# EasyEDA schematic SCH_PoC Interrupt Jao.json
TITLE: PoC Interrupt; REV: 1.0; Date: 15/12/2023; Sheet: 1/1; Drawn By: Jao Dekeyser; Company: HoGent
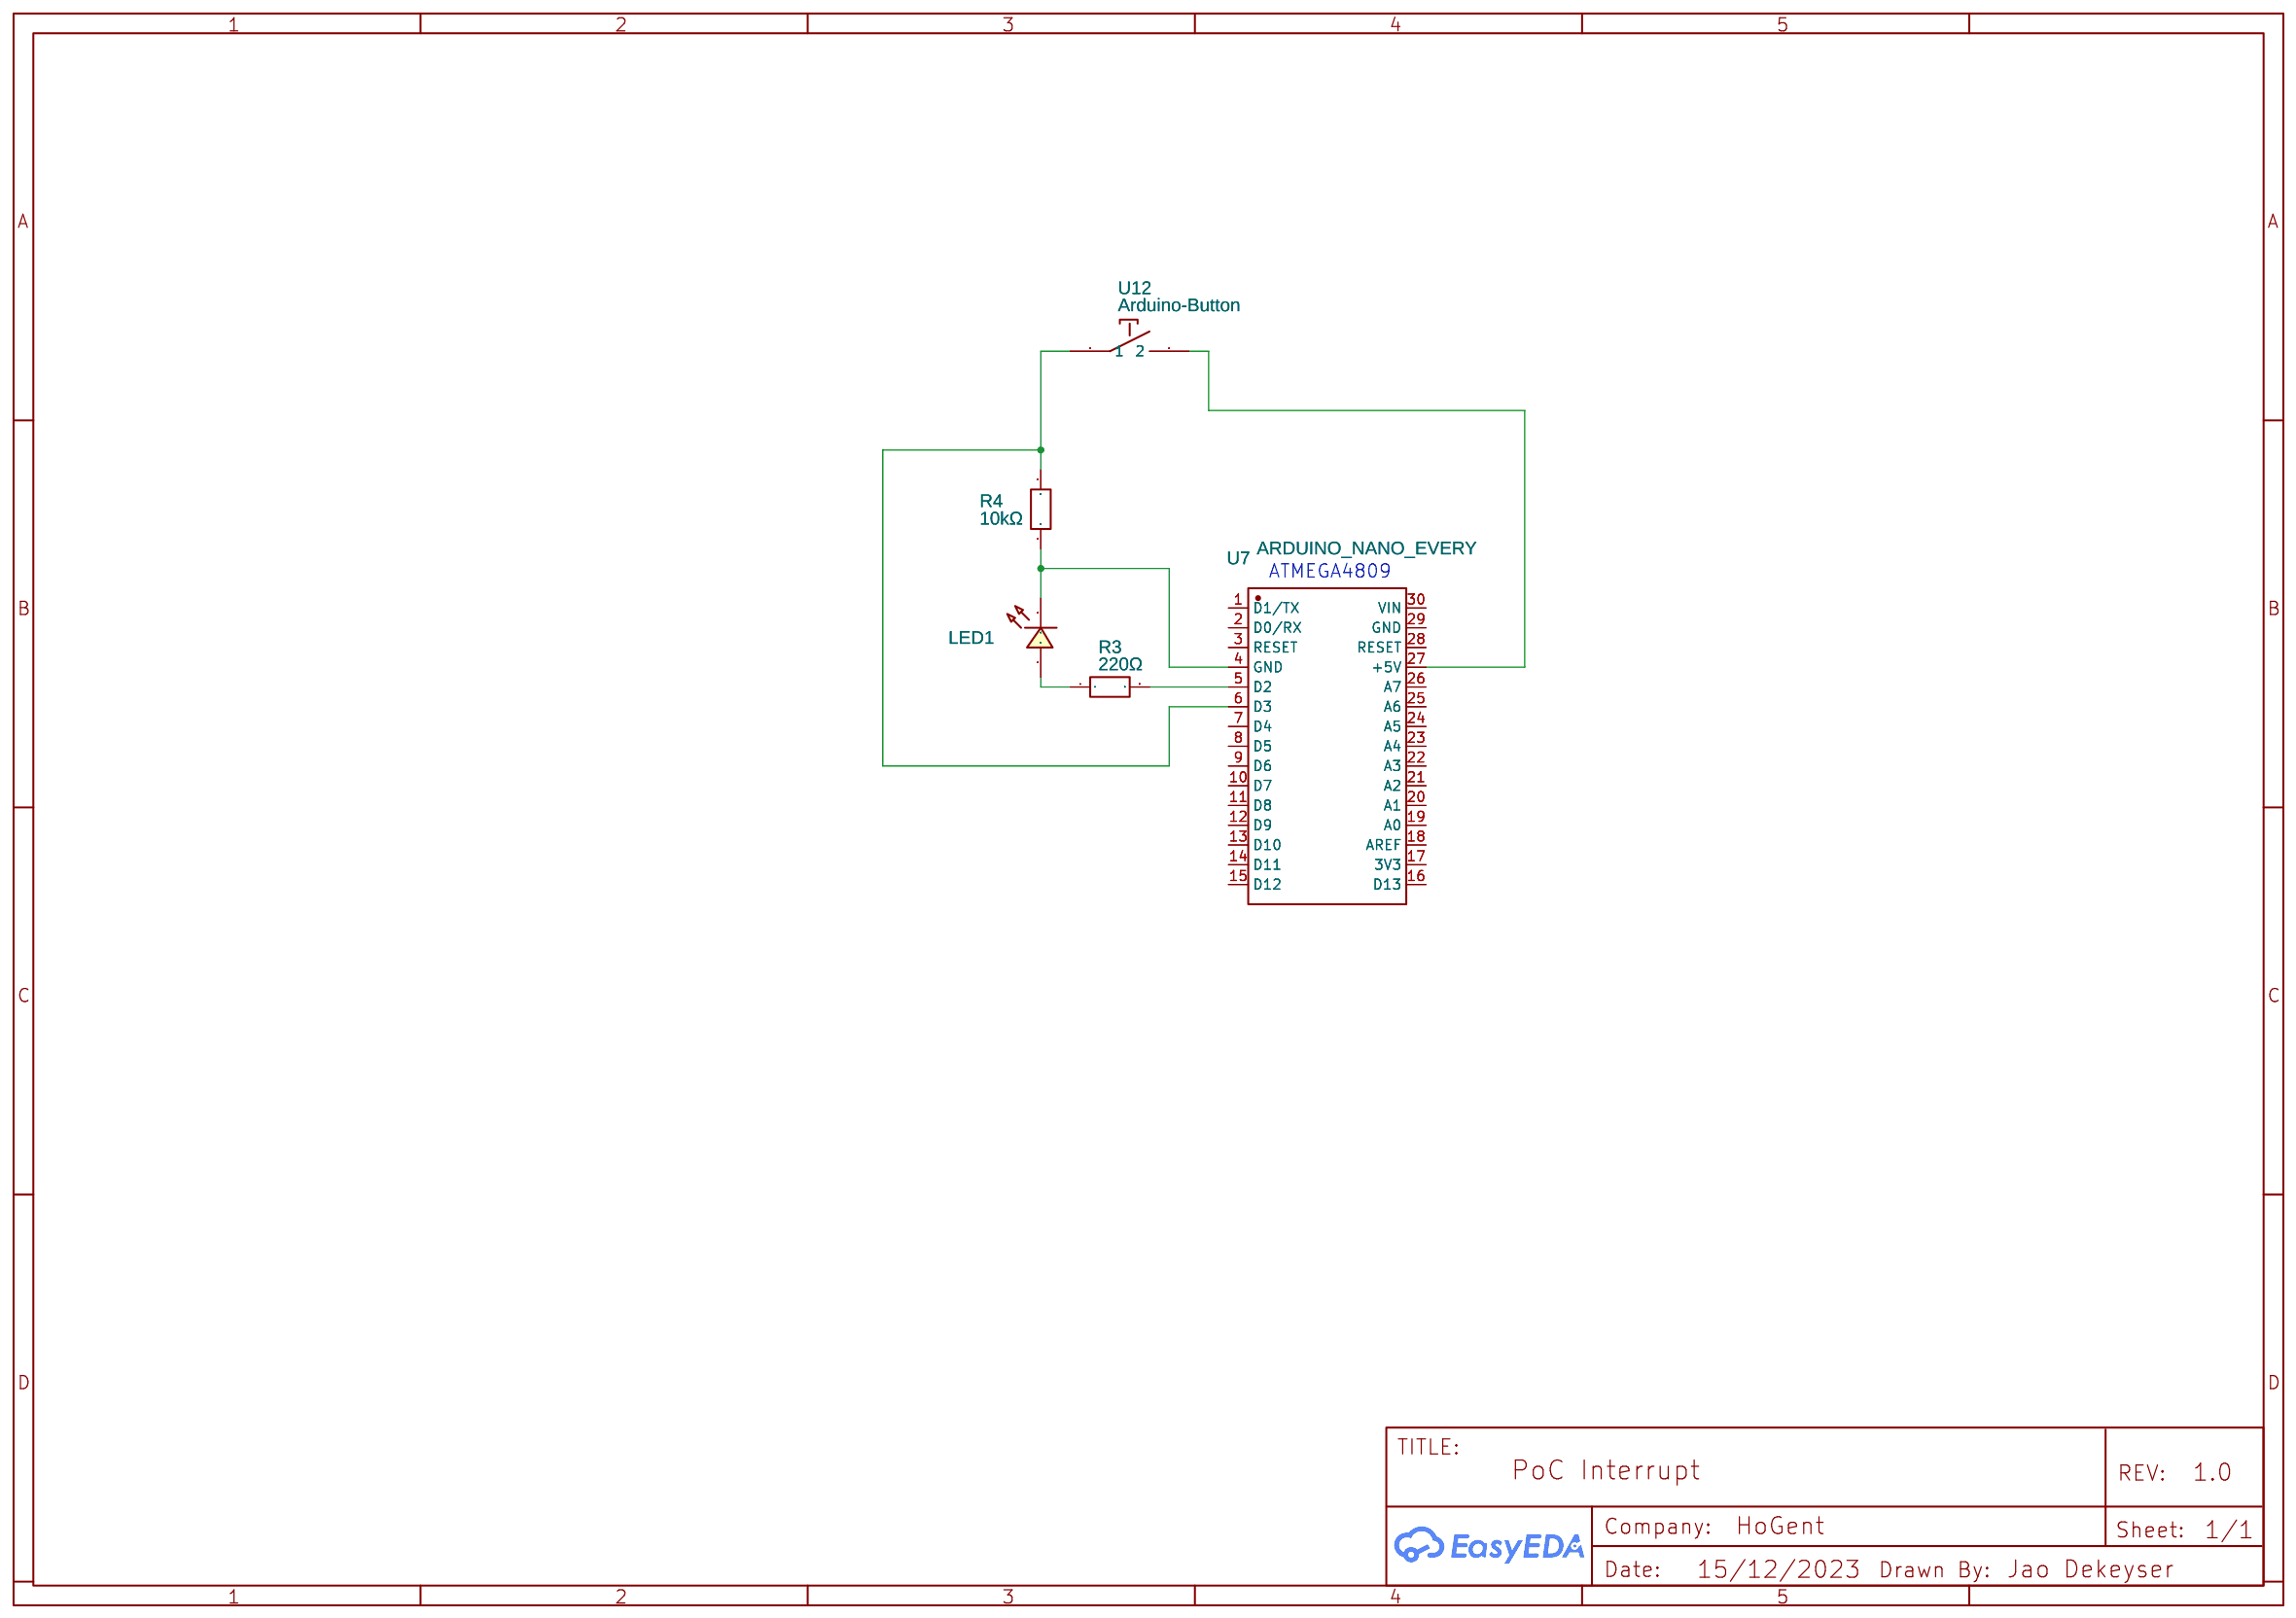
[diagram p0: schematic sheet]

## Parts
LED1  LED-TH-5mm_R  [LED-TH_BD5.0_RED]
R3  220Ω  [AXIAL RESISTOR 220 OHM - TH_BD2.3-L6.0-P10.00-D0.4]
R4  10kΩ  [AXIAL RESISTOR 220 OHM - TH_BD2.3-L6.0-P10.00-D0.4]
U7  ARDUINO_NANO_EVERY  [COMM-TH_ARDUINO_NANO]
U12  Arduino-Button  [ARDUINOBUTTON_SCHEMATIC]

## Library data of the parts
LED1 = LED-TH-5mm_R: Manufacturer: EVERLIGHT(台湾亿光); Manufacturer Part: 333-2SURD/S530-A3; Supplier Part: C87271; Supplier: LCSC; Contributor: LCEDA_Lib
R3 R4 = AXIAL RESISTOR 220 OHM - TH_BD2.3-L6.0-P10.00-D0.4: Contributor: Waleed Kies; JLCPCB Part Class: Extended Part
U7 = ARDUINO_NANO: Contributor: lcsc; Supplier: LCSC; Supplier Part: C9900017879; Manufacturer: null; JLCPCB Part Class: Extended Part; link: https://lcsc.com/eda_search?q=C9900017879&%26type=1&ref=editor
U12 = Arduino-Button: Manufacturer Part: SW100664; Supplier Part: SW100664; Contributor: RasenderReporter

## Nets
Net-(LED1-1): LED1.1 R3.1
Net-(LED1-2): LED1.2 R4.1 U7.4(GND)
Net-(R3-2): R3.2 U7.5(D2)
Net-(R4-2): R4.2 U7.6(D3) U12.1
Net-(U7-27): U7.27(+5V) U12.2

Not connected (* = marked no-connect by the designer): U7 1(D1/TX) 2(D0/RX) 3(RESET) 7(D4) 8(D5) 9(D6) 10(D7) 11(D8) 12(D9) 13(D10) 14(D11) 15(D12) 16(D13) 17(3V3) 18(AREF) 19(A0) 20(A1) 21(A2) 22(A3) 23(A4) 24(A5) 25(A6) 26(A7) 28(RESET) 29(GND) 30(VIN)

## Notes on the sheet
- ATMEGA4809
